# EAGLE schematic 4brar07_Audio_Amplifier (EAGLE 9.6.2)
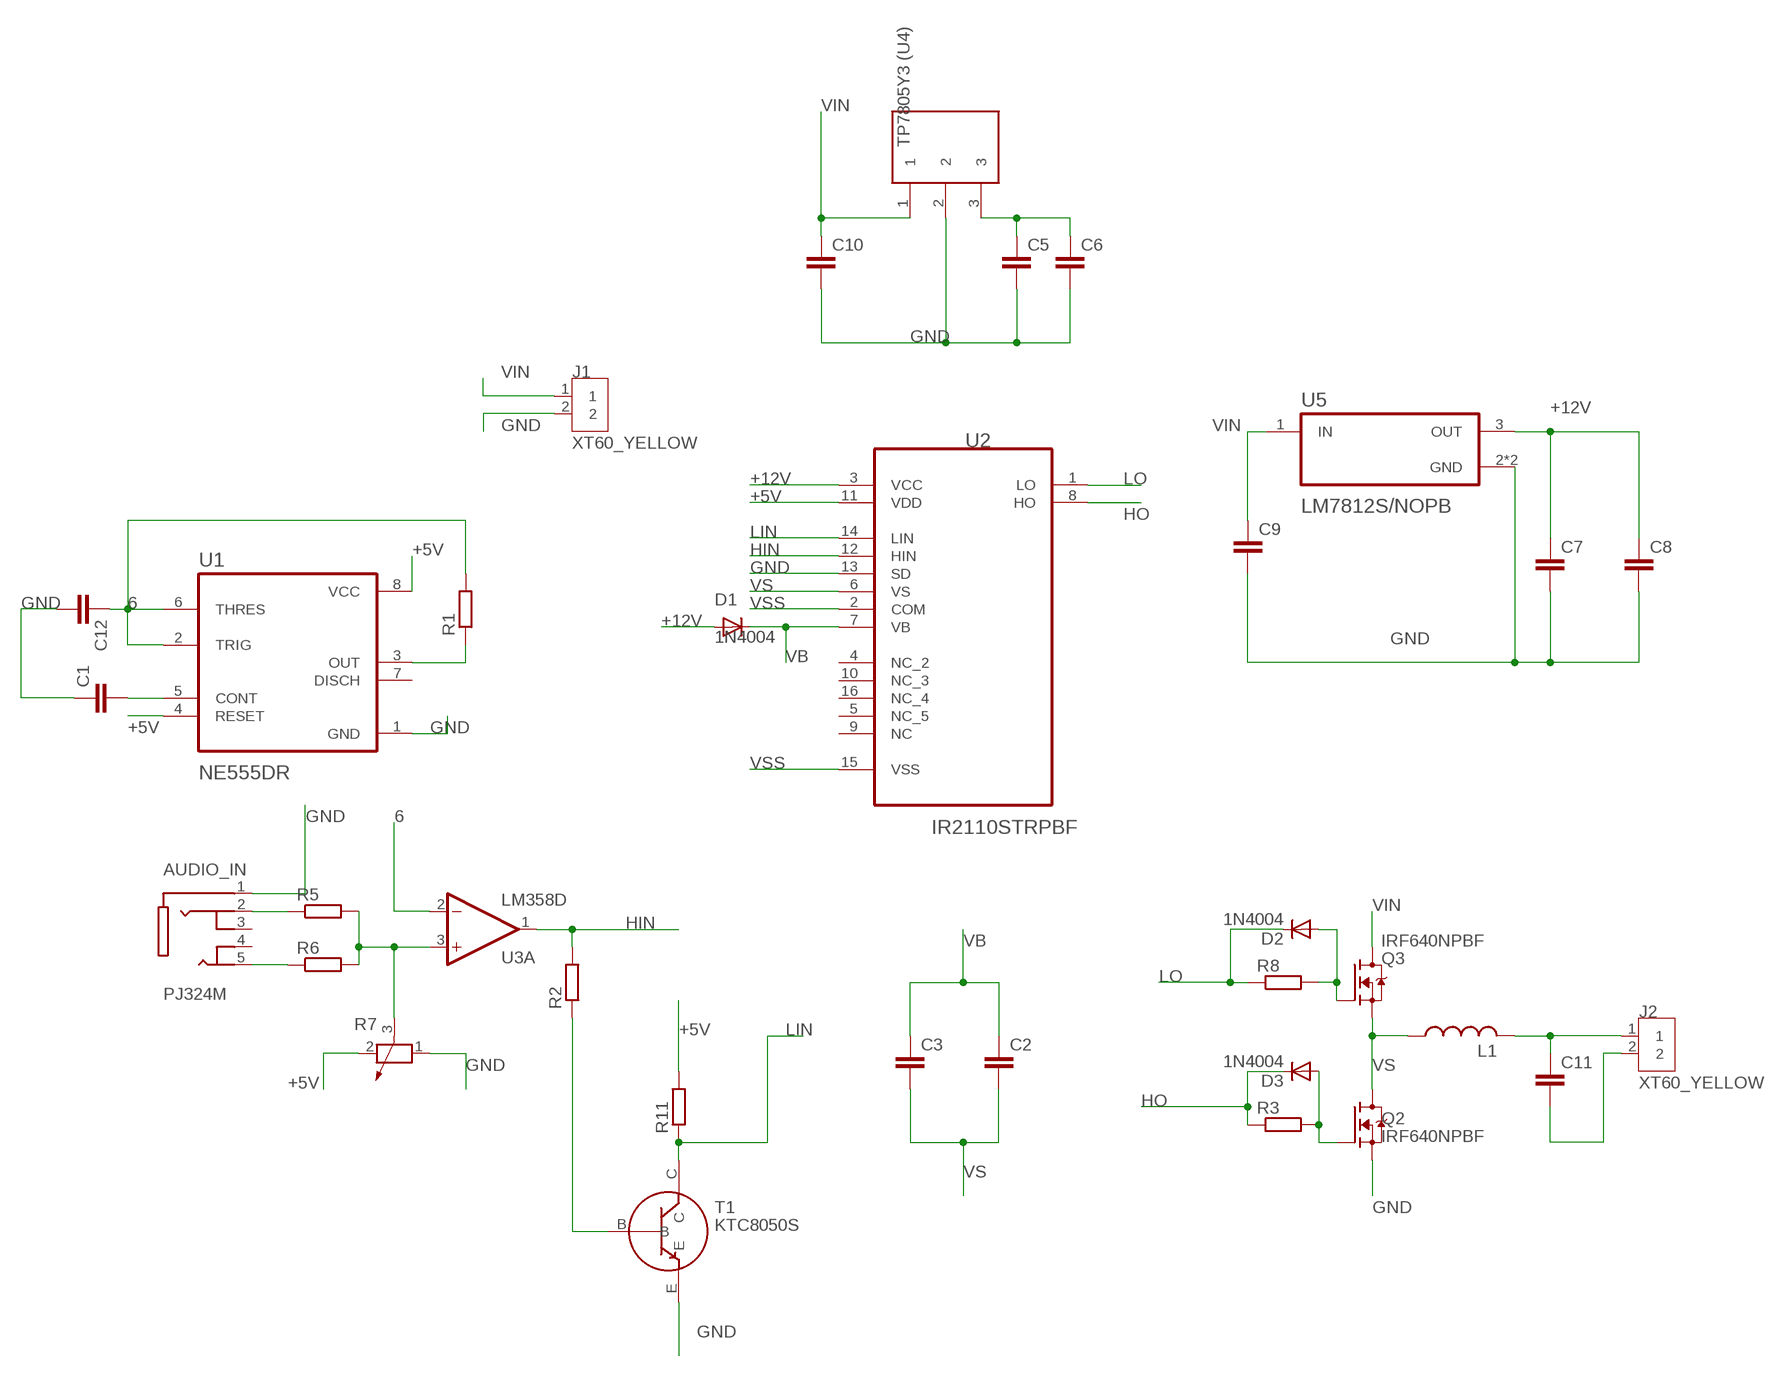
[diagram p0: schematic, sheet 1]

## Parts
AUDIO_IN  PJ324M  [WENZHOU_PJ324M]
C1  C-EU025-025X050  [C025-025X050]
C2  C-EU025-025X050  [C025-025X050]
C3  C-EU025-025X050  [C025-025X050]
C5  C-EU025-025X050  [C025-025X050]
C6  C-EU025-025X050  [C025-025X050]
C7  C-EU025-025X050  [C025-025X050]
C8  C-EU025-025X050  [C025-025X050]
C9  C-EU025-025X050  [C025-025X050]
C10  C-EU025-025X050  [C025-025X050]
C11  C-EU025-025X050  [C025-025X050]
C12  C-EU025-025X050  [C025-025X050]
D1  1N4004  [DO41-10]
D2  1N4004  [DO41-10]
D3  1N4004  [DO41-10]
J1  XT60_YELLOW  [AMASS_XT60PB-M]
J2  XT60_YELLOW  [AMASS_XT60PB-M]
L1  L-US0207/10  [0207/10]
Q2  IRF640NPBF  [TO254P1067X483X2057-3]
Q3  IRF640NPBF  [TO254P1067X483X2057-3]
R1  R-EU_0204/7  [0204/7]
R2  R-EU_0204/7  [0204/7]
R3  R-EU_0204/7  [0204/7]
R5  R-EU_0204/7  [0204/7]
R6  R-EU_0204/7  [0204/7]
R7  POTENTIOMETER_PT-10  [PT-10]
R8  R-EU_0204/7  [0204/7]
R11  R-EU_0204/7  [0204/7]
T1  KTC8050S  [KTC8050S]
TP7805Y3  TP7805Y3  [TP7805Y3]
U1  NE555DR  [SOIC127P599X175-8N]
U2  IR2110STRPBF  [SOIC127P1032X265-16N]
U3  LM358D  [SO08]
U5  LM7812S/NOPB  [TO254P1524X483-4N]

## Nets
6: C12.1 R1.2 U1.2(TRIG) U1.6(THRES) U3.2(A:-IN)
+5V [power]: R7.2 R11.2 U1.4(RESET) U1.8(VCC) U2.11(VDD)
+12V [power]: C7.1 C8.1 D1.A U2.3(VCC) U5.3(OUT)
GND [power]: AUDIO_IN.1(SLEEVE) C1.1 C5.2 C6.2 C7.2 C8.2 C9.2 C10.2 C12.2 J1.2 Q2.3(S) R7.1 T1.E TP7805Y3.2 U1.1(GND) U2.13(SD) U5.2(GND) U5.4(GND)
HIN: R2.2 U2.12(HIN) U3.1(A:OUT)
HO: D3.C R3.1 U2.8(HO)
LIN: R11.1 T1.C U2.14(LIN)
LO: D2.C R8.1 U2.1(LO)
N$1: C11.1 J2.1 L1.2
N$2: C11.2 J2.2
N$3: C5.1 C6.1 TP7805Y3.3
N$5: AUDIO_IN.2(RING_1) R5.1
N$6: D2.A Q3.1(G) R8.2
N$7: D3.A Q2.1(G) R3.2
N$8: R1.1 U1.3(OUT)
N$9: R5.2 R6.2 R7.3 U3.3(A:+IN)
N$10: AUDIO_IN.5(TIP_2) R6.1
N$11: C1.2 U1.5(CONT)
N$12: R2.1 T1.B
VB: C2.1 C3.1 D1.C U2.7(VB)
VIN [power]: C9.1 C10.1 J1.1 Q3.2(D) TP7805Y3.1 U5.1(IN)
VS: C2.2 C3.2 L1.1 Q2.2(D) Q3.3(S) U2.6(VS)
VSS [power]: U2.2(COM) U2.15(VSS)
Unconnected: AUDIO_IN.3(RING_2) AUDIO_IN.4(TIP_1) U1.7(DISCH) U2.4(NC_2) U2.5(NC_5) U2.9(NC) U2.10(NC_3) U2.16(NC_4) U3.5(B:+IN) U3.6(B:-IN) U3.7(B:OUT)

## Power pins joined to a net without a drawn wire
V+: U3.8(P:V+)
V-: U3.4(P:V-)

## Library data of the parts
AUDIO_IN = PJ324M:PJ324M: Check availability <https://pricing.snapeda.com/parts/PJ324M/Wenzhou%20QingPu%20Electronics%20Co.Ltd/view-part?ref=eda>; AVAILABILITY: Not in stock; CHECK_PRICES: https://www.snapeda.com/parts/PJ324M/Wenzhou+QingPu+Electronics+Co.Ltd/view-part/?ref=eda; DESCRIPTION: Headphone Stereo jack/Audio connector; MF: Wenzhou QingPu Electronics Co.Ltd; MP: PJ324M; PACKAGE: Package; PRICE: None; SNAPEDA_LINK: https://www.snapeda.com/parts/PJ324M/Wenzhou+QingPu+Electronics+Co.Ltd/view-part/?ref=snap
C1-C3 C5-C12 = rcl:C-EU: CAPACITOR, European symbol; SPICEPREFIX: C
D1-D3 = adafruit:1N4004: DIODE General purpose 1N400x type rectifier (With bigger pads) http://www.ladyada.net/library/pcb/eaglelibrary.html
J1 J2 = XT60_YELLOW:XT60_YELLOW: Check availability <https://pricing.snapeda.com/parts/XT60%20YELLOW/Pololu/view-part?ref=eda>; AVAILABILITY: Not in stock; CHECK_PRICES: https://www.snapeda.com/parts/XT60%20YELLOW/Pololu/view-part/?ref=eda; DESCRIPTION: Power connector; 65A; PIN: 2; Colour: yellow; MF: Pololu; MP: XT60 YELLOW; PACKAGE: None; PRICE: None; SNAPEDA_LINK: https://www.snapeda.com/parts/XT60%20YELLOW/Pololu/view-part/?ref=snap
L1 = rcl:L-US: INDUCTOR, American symbol; SPICEPREFIX: L
Q2 Q3 = IRF640NPBF:IRF640NPBF: Check availability <https://pricing.snapeda.com/parts/IRF640NPBF/Infineon/view-part?ref=eda>; AVAILABILITY: In Stock; CHECK_PRICES: https://www.snapeda.com/parts/IRF640NPBF/Infineon/view-part/?ref=eda; DESCRIPTION: MOSFET, Power,N-Ch,VDSS 200V,RDS(ON) 0.15Ohm,ID 18A,TO-220AB,PD 150W,VGS +/-20V | Infineon IRF640NPBF; MF: Infineon; MP: IRF640NPBF; PACKAGE: TO-220-3 Infineon; PRICE: None; SNAPEDA_LINK: https://www.snapeda.com/parts/IRF640NPBF/Infineon/view-part/?ref=snap
R1-R3 R5 R6 R8 R11 = rcl:R-EU_: RESISTOR, European symbol; SPICEPREFIX: R
R7 = rcl:POTENTIOMETER_: Potentiometer; SPICEMODEL: POT; SPICEPREFIX: X
T1 = KTC8050S:KTC8050S
TP7805Y3 = TP7805Y3:TP7805Y3; TP7805Y3: TP7805Y3 (U4)
U1 = NE555DR:NE555DR: Check availability <https://pricing.snapeda.com/parts/NE555DR/Texas%20Instruments/view-part?ref=eda>; AVAILABILITY: In Stock; CHECK_PRICES: https://www.snapeda.com/parts/NE555DR/Texas+Instruments/view-part/?ref=eda; DESCRIPTION: Single Precision Timer; MF: Texas Instruments; MP: NE555DR; PACKAGE: SOIC-8 Texas Instruments; PRICE: None; SNAPEDA_LINK: https://www.snapeda.com/parts/NE555DR/Texas+Instruments/view-part/?ref=snap
U2 = IR2110STRPBF:IR2110STRPBF: Check availability <https://pricing.snapeda.com/parts/IR2110STRPBF/Infineon/view-part?ref=eda>; AVAILABILITY: In Stock; CHECK_PRICES: https://www.snapeda.com/parts/IR2110STRPBF/Infineon/view-part/?ref=eda; DESCRIPTION: Half-Bridge Gate Driver IC Non-Inverting 16-SOIC; MF: Infineon; MP: IR2110STRPBF; PACKAGE: SOIC-16 International Rectifier; PRICE: None; SNAPEDA_LINK: https://www.snapeda.com/parts/IR2110STRPBF/Infineon/view-part/?ref=snap
U3 = linear:LM358: OP AMP also LM158; LM258; LM2904 Source: http://cache.national.com/ds/LM/LM158.pdf
U5 = LM7812S_NOPB:LM7812S/NOPB: Check availability <https://pricing.snapeda.com/parts/LM7812S/NOPB/Texas%20Instruments/view-part?ref=eda>; AVAILABILITY: In Stock; CHECK_PRICES: https://www.snapeda.com/parts/LM7812S/NOPB/Texas+Instruments/view-part/?ref=eda; DESCRIPTION: 1.5-A, 30-V, linear voltage regulator; MF: Texas Instruments; MP: LM7812S/NOPB; PACKAGE: TO263-3 Texas Instruments; PRICE: None; SNAPEDA_LINK: https://www.snapeda.com/parts/LM7812S/NOPB/Texas+Instruments/view-part/?ref=snap

## Net classes
0 default: width 0.25 mm
1 power: width 0.35 mm